# EAGLE design tc0060dca_test (EAGLE 9.6.2)
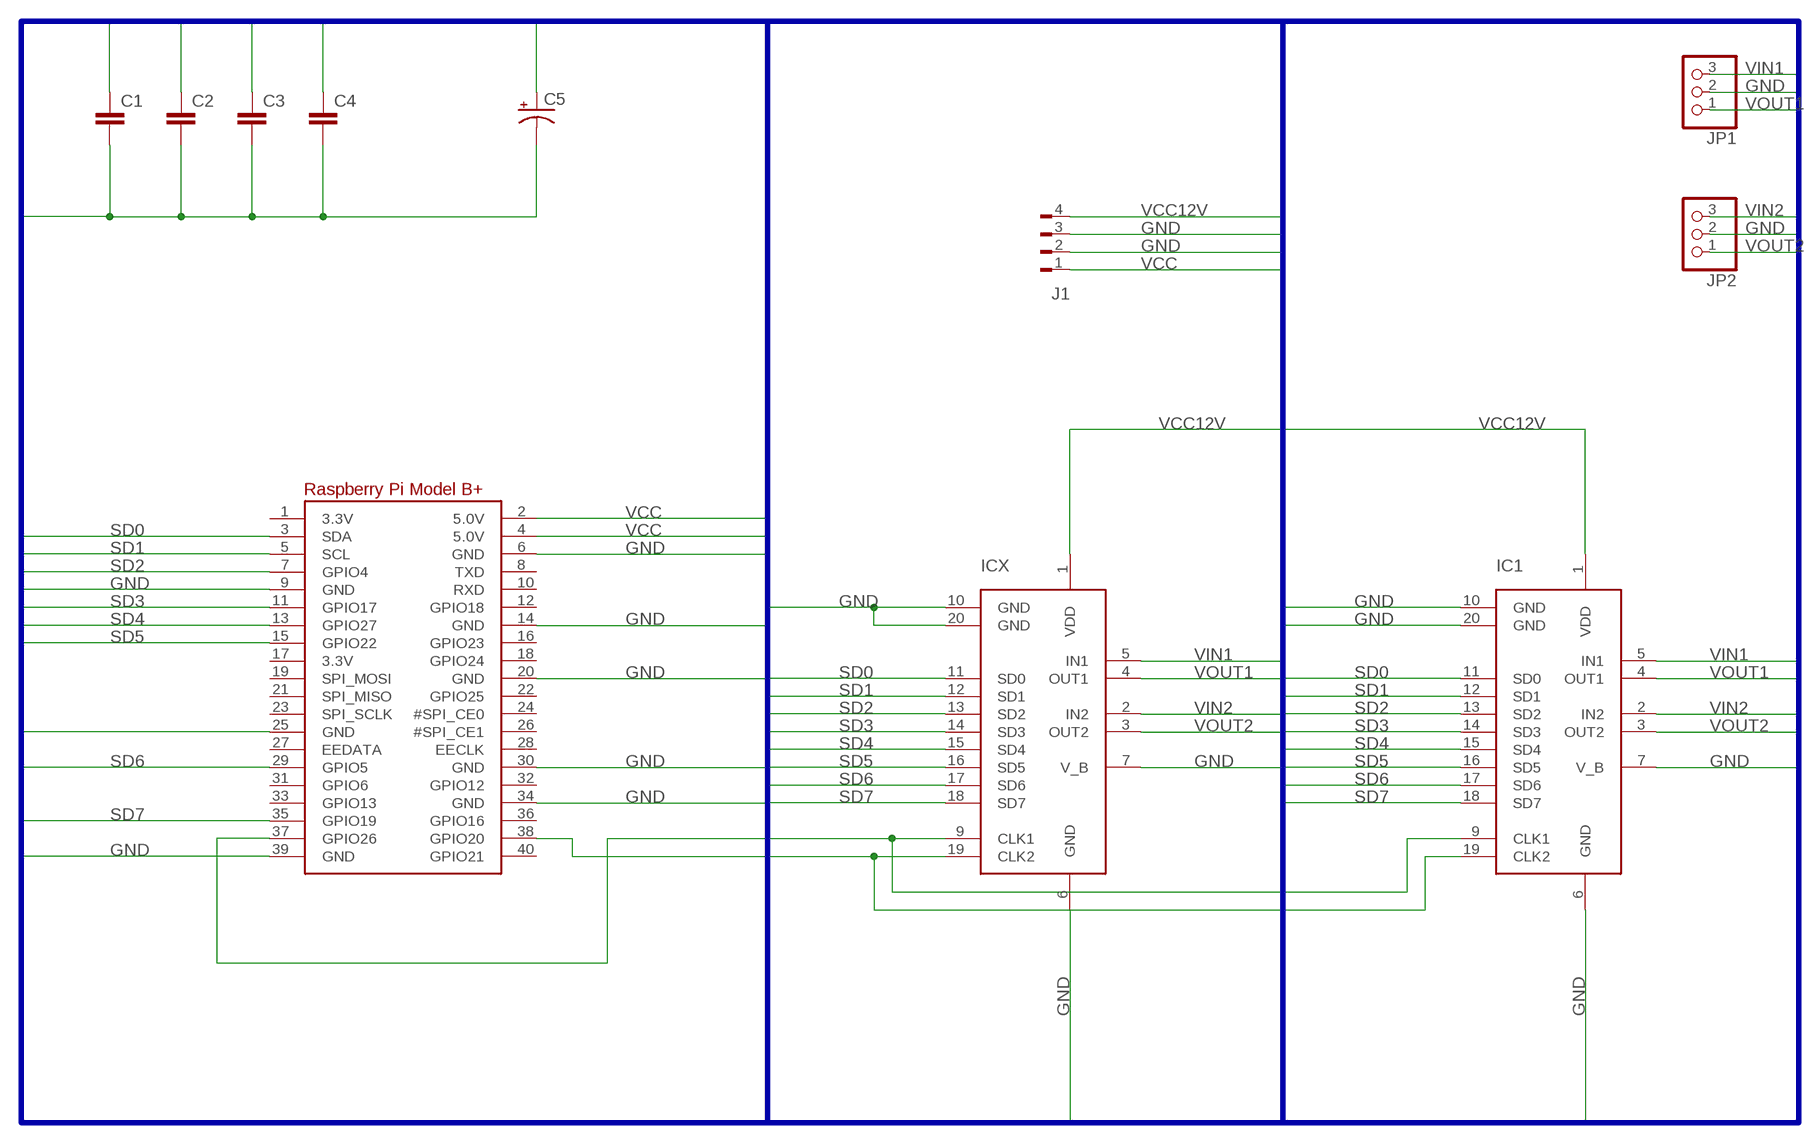
[diagram p0: schematic, sheet 1]

## Parts
C1  CC1206  [C1206]
C2  CC1206  [C1206]
C3  CC1206  [C1206]
C4  CC1206  [C1206]
C5  CPOL-USTT5D9  [TT5D9]
IC1  TC0060DCA  [1X20]
ICX  TC0060DCA  [1X20]
J1  FLOP-4W  [FLOP-4V]
JP1  PINHD-1X3  [1X03]
JP2  PINHD-1X3  [1X03]
RPI1  RASPBERRYPI_BPLUS_IDC  [2X20]

## Nets
GND: C1.2 C2.2 C3.2 C4.2 C5.- IC1.6(GND) IC1.7(V_B) IC1.10(GND) IC1.20(GND) ICX.6(GND) ICX.7(V_B) ICX.10(GND) ICX.20(GND) J1.2 J1.3 JP1.2 JP2.2 RPI1.6(GND) RPI1.9(GND) RPI1.14(GND) RPI1.20(GND) RPI1.25(GND) RPI1.30(GND) RPI1.34(GND) RPI1.39(GND)
N$3: IC1.9(CLK1) ICX.9(CLK1) RPI1.37(GPIO26)
N$4: IC1.19(CLK2) ICX.19(CLK2) RPI1.38(GPIO20)
SD0: IC1.11(SD0) ICX.11(SD0) RPI1.3(SDA)
SD1: IC1.12(SD1) ICX.12(SD1) RPI1.5(SCL)
SD2: IC1.13(SD2) ICX.13(SD2) RPI1.7(GPIO4)
SD3: IC1.14(SD3) ICX.14(SD3) RPI1.11(GPIO17)
SD4: IC1.15(SD4) ICX.15(SD4) RPI1.13(GPIO27)
SD5: IC1.16(SD5) ICX.16(SD5) RPI1.15(GPIO22)
SD6: IC1.17(SD6) ICX.17(SD6) RPI1.29(GPIO5)
SD7: IC1.18(SD7) ICX.18(SD7) RPI1.35(GPIO19)
VCC: C1.1 C2.1 C3.1 J1.1 RPI1.2(5.0V) RPI1.4(5.0V)
VCC12V: C4.1 C5.+ IC1.1(VDD) ICX.1(VDD) J1.4
VIN1: IC1.5(IN1) ICX.5(IN1) JP1.3
VIN2: IC1.2(IN2) ICX.2(IN2) JP2.3
VOUT1: IC1.4(OUT1) ICX.4(OUT1) JP1.1
VOUT2: IC1.3(OUT2) ICX.3(OUT2) JP2.1
Unconnected: RPI1.1(3.3V) RPI1.8(TXD) RPI1.10(RXD) RPI1.12(GPIO18) RPI1.16(GPIO23) RPI1.17(3.3V) RPI1.18(GPIO24) RPI1.19(SPI_MOSI) RPI1.21(SPI_MISO) RPI1.22(GPIO25) RPI1.23(SPI_SCLK) RPI1.24(#SPI_CE0) RPI1.26(#SPI_CE1) RPI1.27(EEDATA) RPI1.28(EECLK) RPI1.31(GPIO6) RPI1.32(GPIO12) RPI1.33(GPIO13) RPI1.36(GPIO16) RPI1.40(GPIO21)

## Buses
GND,SD[0..7],VCC,VCC12V,VIN[1..2],VOUT[1..2]

## Library data of the parts
C1-C4 = eagle-ltspice:C: CAPACITOR, European symbol; SPICEMODEL: NONE; SPICEPREFIX: C
C5 = adafruit:CPOL-US: POLARIZED CAPACITOR, American symbol
IC1 ICX = OpWolf:TC0060DCA
J1 = con-amp:FLOP-4W: MATE N-LOCK Floppy / HDD conector Distributor: Bürklin 71F972
JP1 JP2 = adafruit:PINHD-1X3: PIN HEADER
RPI1 = microbuilder:RASPBERRYPI_BPLUS

## Board
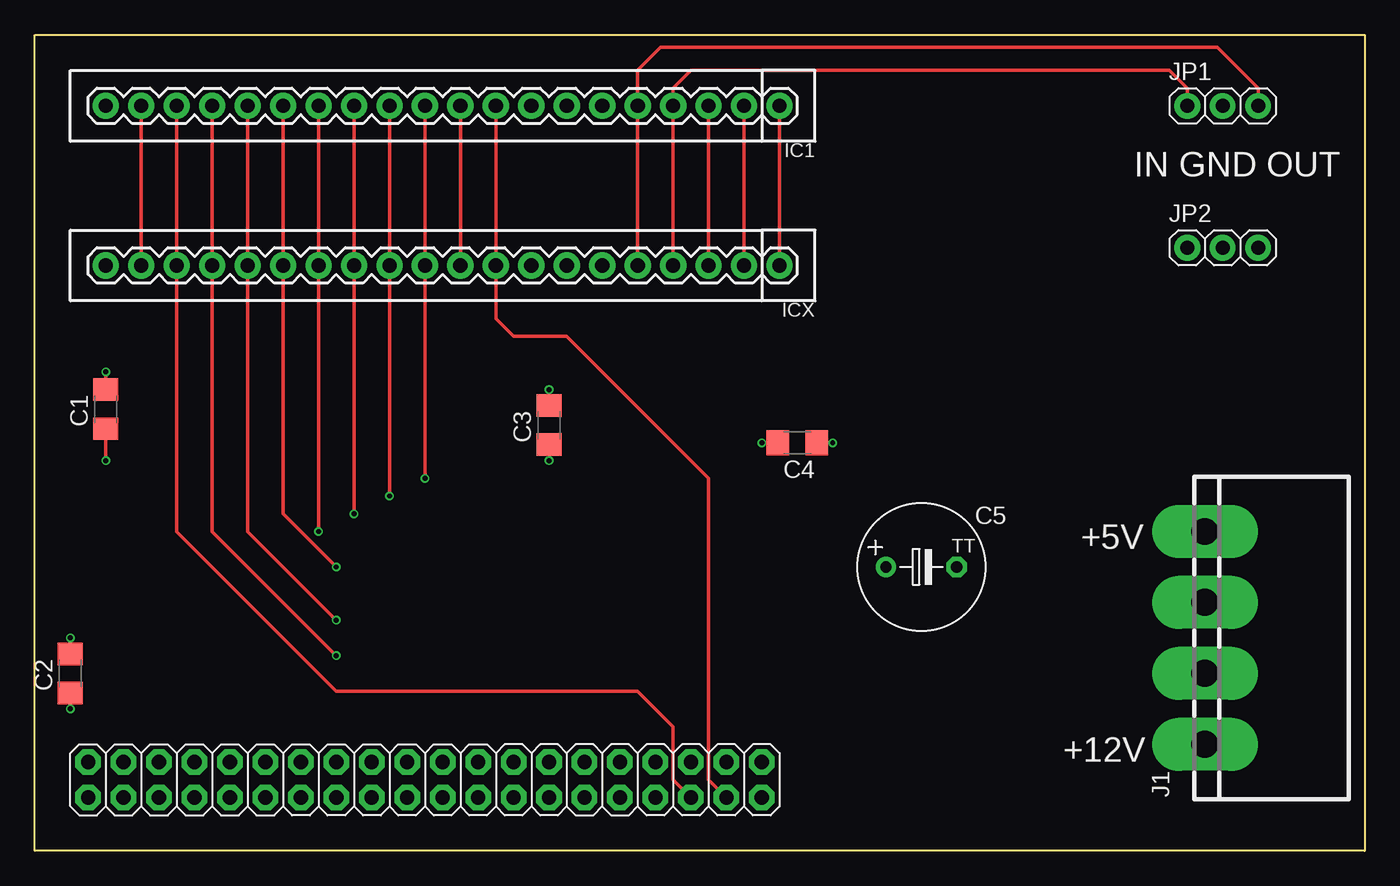
[diagram p1: board, top side]
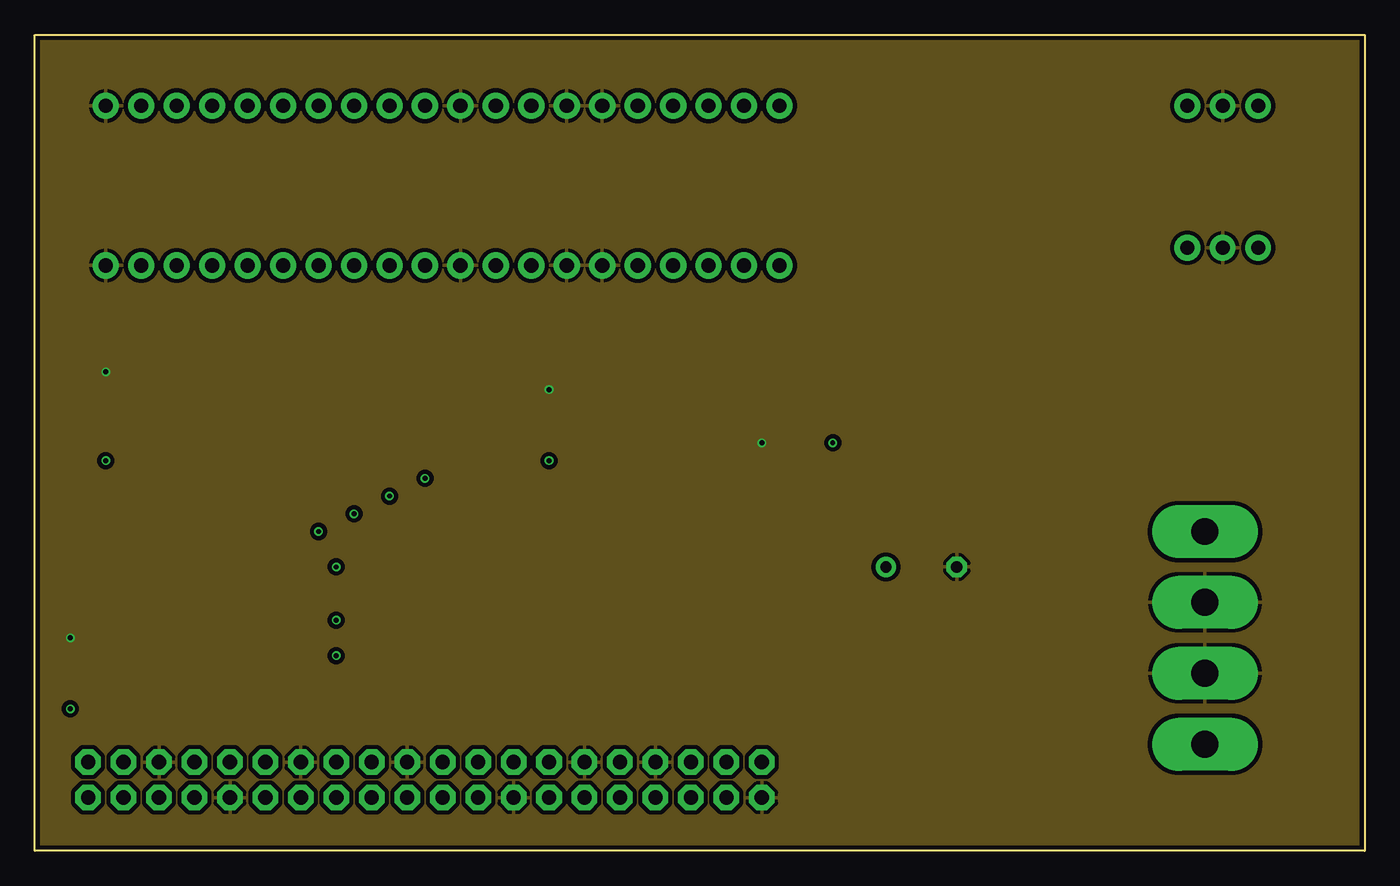
[diagram p2: board, inner layer Route2]
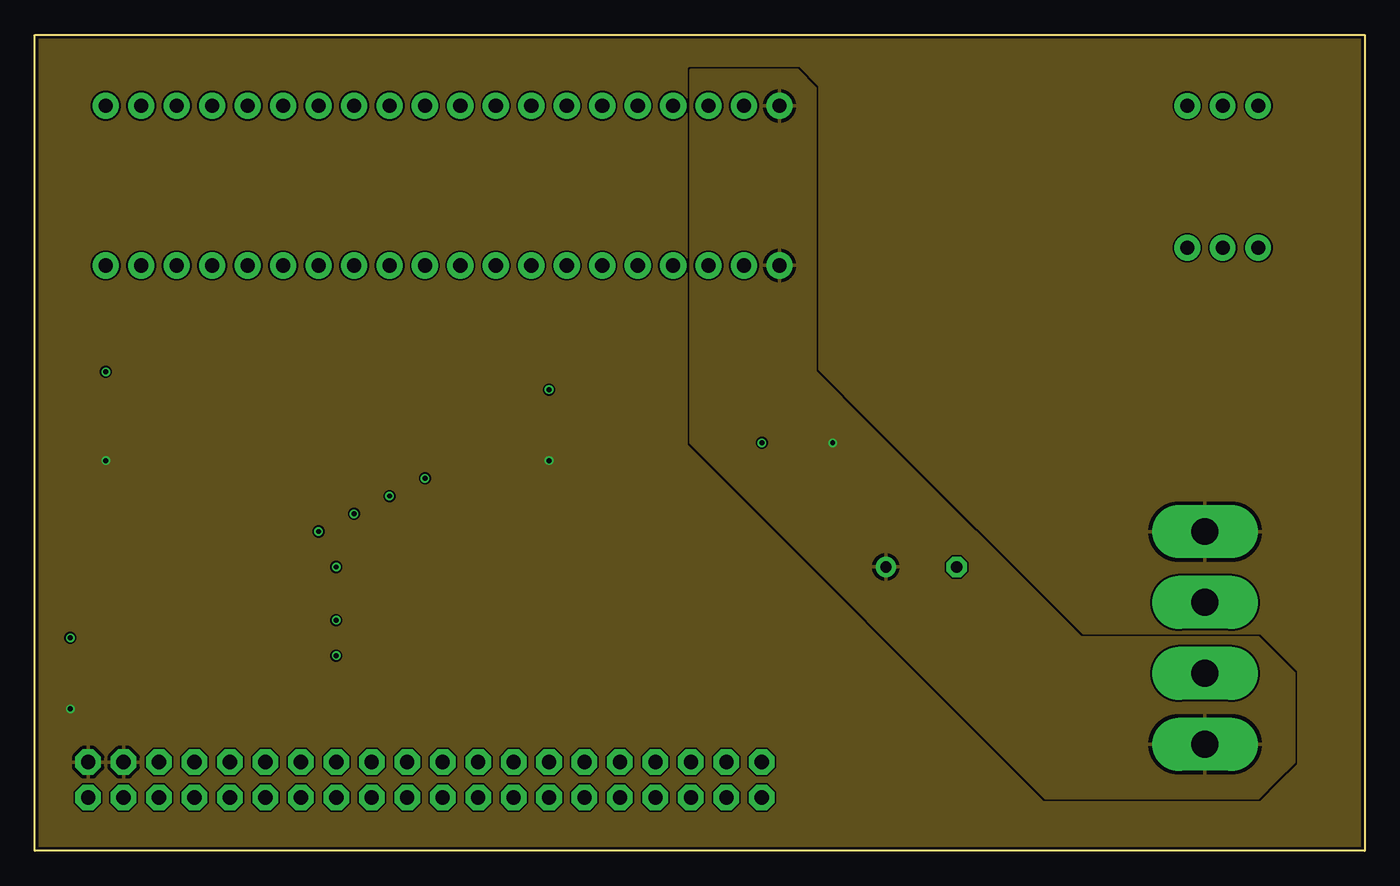
[diagram p3: board, inner layer Route15]
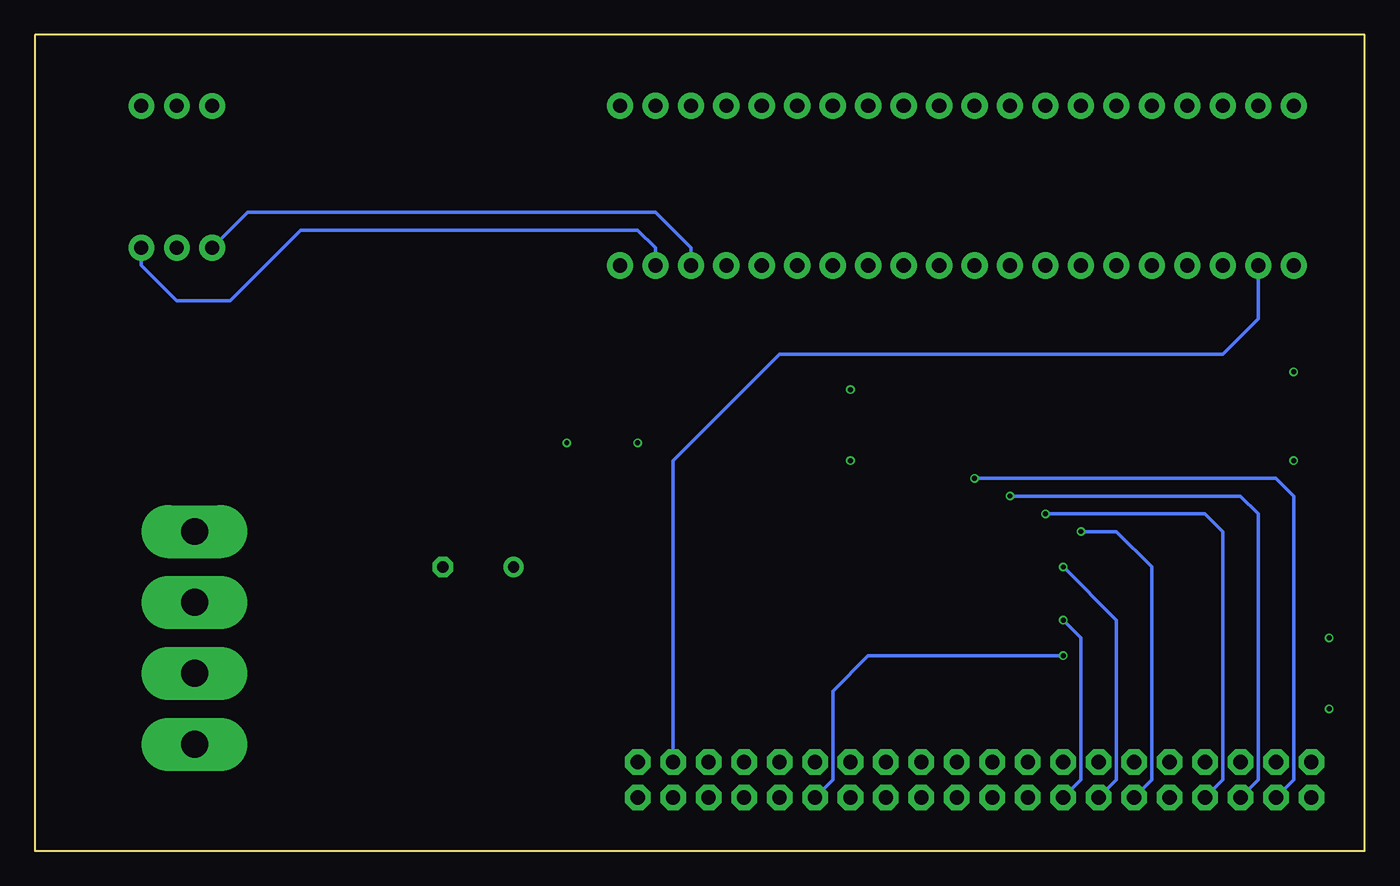
[diagram p4: board, bottom side, seen from below]

Size 95.25 x 58.42 mm. Coordinates in mm from the lower left corner, seen from the top.
Outline: 0,0 0,58.42 95.25,58.42 95.25,0 0,0
Copper layers (1+2*15+16): Top 0.035mm / dielectric 0.2mm / Route2 0.0175mm / dielectric 1.065mm / Route15 0.0175mm / dielectric 0.2mm / Bottom 0.035mm
Design rules "jlcpcb-4layers": minimum track width 3.5mil, minimum drill 0.2mm, track to track 5mil, track to pad 0.2mm, pad to pad 5mil, via to via 0.5mm, smd to smd 5mil, copper to edge 0.2mm, drill to drill 6mil, minimum pad ring 10mil, minimum via ring 0.13mm, stop-mask expansion 0.05mm, vias tented up to drill 16mil, thermal gap 10mil

### Footprints (pad centres in the part's own frame; a part is rotated, then mirrored left to right if it is on the bottom)
C1206 = smd 1.6 x 1.8: 1 -1.4,0; 2 1.4,0
TT5D9 = drill 0.813: + -2.54,0 | drill 0.813 octagon: - 2.54,0
1X20 = drill 1.016 pad 1.88: 1 0,0; 2 2.54,0; 3 5.08,0; 4 7.62,0; 5 10.16,0; 6 12.7,0; 7 15.24,0; 8 17.78,0; 9 20.32,0; 10 22.86,0; 11 25.4,0; 12 27.94,0; 13 30.48,0; 14 33.02,0; 15 35.56,0; 16 38.1,0; 17 40.64,0; 18 43.18,0; 19 45.72,0; 20 48.26,0
FLOP-4V = drill 1.93 pad 3.81 long: 1 7.62,0; 2 2.54,0; 3 -2.54,0; 4 -7.62,0
1X03 = drill 1.016: 1 -2.54,0; 2 0,0; 3 2.54,0
2X20 = drill 1.016 octagon: 1 -24.13,-1.27; 2 -24.13,1.27; 3 -21.59,-1.27; 4 -21.59,1.27; 5 -19.05,-1.27; 6 -19.05,1.27; 7 -16.51,-1.27; 8 -16.51,1.27; 9 -13.97,-1.27; 10 -13.97,1.27; 11 -11.43,-1.27; 12 -11.43,1.27; 13 -8.89,-1.27; 14 -8.89,1.27; 15 -6.35,-1.27; 16 -6.35,1.27; 17 -3.81,-1.27; 18 -3.81,1.27; 19 -1.27,-1.27; 20 -1.27,1.27; 21 1.27,-1.27; 22 1.27,1.27; 23 3.81,-1.27; 24 3.81,1.27; 25 6.35,-1.27; 26 6.35,1.27; 27 8.89,-1.27; 28 8.89,1.27; 29 11.43,-1.27; 30 11.43,1.27; 31 13.97,-1.27; 32 13.97,1.27; 33 16.51,-1.27; 34 16.51,1.27; 35 19.05,-1.27; 36 19.05,1.27; 37 21.59,-1.27; 38 21.59,1.27; 39 24.13,-1.27; 40 24.13,1.27

### Placement (x,y rotation side)
C1  5.08,31.62 90 top
C2  2.54,12.7 90 top
C3  36.83,30.48 90 top
C4  54.61,29.21 180 top
C5  63.5,20.32 0 top
IC1  53.34,53.34 180 top
ICX  53.34,41.91 180 top
J1  83.82,15.24 90 top
JP1  85.09,53.34 0 top
JP2  85.09,43.18 0 top
RPI1  27.94,5.08 0 top

### Tracks (layer width: path | path; a pad name or v marks a point on that pad's centre or on a via)
GND  (via drill 0.35)
  Top 0.254: IC1.10 ICX.10 | C4.2 v52.07,29.21 | C3.2 v36.83,33.02 | C1.2 v5.08,34.29 | C2.2 v2.54,15.24
  pour Route2 (isolate 0.305): 95.25,0 0,0 0,58.42 95.25,58.42
N$3
  Top 0.254: IC1.9 ICX.9 33.02,38.1 34.29,36.83 38.1,36.83 48.26,26.67 48.26,5.08 RPI1.37
N$4
  Top 0.254: IC1.19 ICX.19
  Bottom 0.254: ICX.19 7.62,38.1 10.16,35.56 41.91,35.56 49.53,27.94 RPI1.38
SD0  (via drill 0.35)
  Top 0.254: IC1.11 ICX.11 v27.94,26.67
  Bottom 0.254: v27.94,26.67 6.35,26.67 5.08,25.4 5.08,5.08 RPI1.3
SD1  (via drill 0.35)
  Top 0.254: IC1.12 ICX.12 v25.4,25.4
  Bottom 0.254: v25.4,25.4 8.89,25.4 7.62,24.13 7.62,5.08 RPI1.5
SD2  (via drill 0.35)
  Top 0.254: IC1.13 ICX.13 v22.86,24.13
  Bottom 0.254: v22.86,24.13 11.43,24.13 10.16,22.86 10.16,5.08 RPI1.7
SD3  (via drill 0.35)
  Top 0.254: IC1.14 ICX.14 v20.32,22.86
  Bottom 0.254: v20.32,22.86 17.78,22.86 15.24,20.32 15.24,5.08 RPI1.11
SD4  (via drill 0.35)
  Top 0.254: IC1.15 ICX.15 17.78,24.13 v21.59,20.32
  Bottom 0.254: v21.59,20.32 17.78,16.51 17.78,5.08 RPI1.13
SD5  (via drill 0.35)
  Top 0.254: IC1.16 ICX.16 15.24,22.86 v21.59,16.51
  Bottom 0.254: v21.59,16.51 20.32,15.24 20.32,5.08 RPI1.15
SD6  (via drill 0.35)
  Top 0.254: IC1.17 ICX.17 12.7,22.86 v21.59,13.97
  Bottom 0.254: v21.59,13.97 35.56,13.97 38.1,11.43 38.1,5.08 RPI1.29
SD7
  Top 0.254: IC1.18 ICX.18 10.16,22.86 21.59,11.43 43.18,11.43 45.72,8.89 45.72,5.08 RPI1.35
VCC  (via drill 0.35)
  Top 0.254: C3.1 v36.83,27.94 | C1.1 v5.08,27.94 | C2.1 v2.54,10.16
  pour Route15 (rank 2): 0,58.42 0,0 95.25,0 95.25,58.42
VCC12V  (via drill 0.35)
  Top 0.254: IC1.1 ICX.1 | C4.1 v57.15,29.21
  pour Route15: 46.99,55.88 46.99,29.21 72.39,3.81 87.63,3.81 88.9,5.08 90.17,6.35 90.17,11.43 90.17,12.7 87.63,15.24 77.47,15.24 74.93,15.24 59.69,30.48 55.88,34.29 55.88,52.07 55.88,54.61 54.61,55.88
VIN1
  Top 0.254: ICX.5 IC1.5 43.18,55.88 44.83,57.53 84.71,57.53 87.63,54.61 JP1.3
VIN2
  Top 0.254: IC1.2 ICX.2
  Bottom 0.254: ICX.2 50.8,43.18 52.07,44.45 76.2,44.45 81.28,39.37 85.09,39.37 87.63,41.91 JP2.3
VOUT1
  Top 0.254: ICX.4 IC1.4 45.72,54.61 46.99,55.88 81.28,55.88 82.55,54.61 JP1.1
VOUT2
  Top 0.254: IC1.3 ICX.3
  Bottom 0.254: JP2.1 80.01,45.72 50.8,45.72 48.26,43.18 ICX.3

### Text on the board
tNames: IN GND OUT | +5V | +12V